# EAGLE design BIRDS-5_FM_-X Panel_Ver2 (EAGLE 9.6.2)
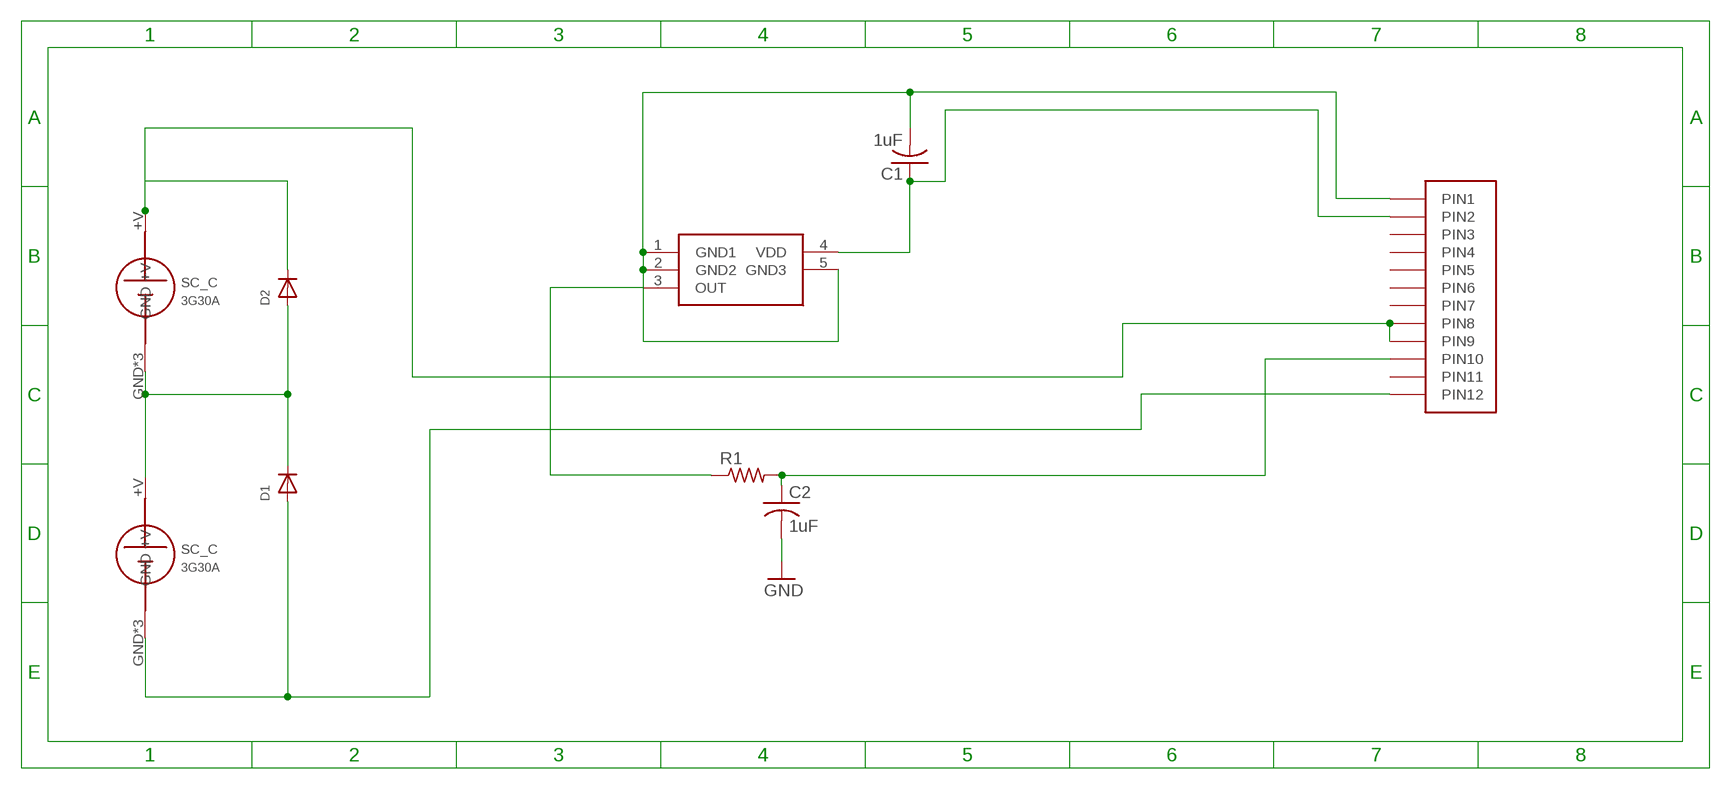
[diagram p0: schematic, sheet 1]

## Parts
C1  1uF  C-USC0805  [C0805]
C2  1uF  C-USC0805  [C0805]
D1  DIODE_SOD-123FL  [SOD-123FL]
D2  DIODE_SOD-123FL  [SOD-123FL]
R1  R-US_R0402  [R0402]
U$1  HEADER12PIN  [HEADER12PIN]
U$3  LMT84DCKT  [SOT65P210X110-5N]
U$4  SC_C  [SC_C]
U$5  SC_C  [SC_C]

## Nets
+V: D2.C U$1.P8(PIN8) U$1.P9(PIN9) U$4.+V
GND: C1.2 C2.2 D1.A U$1.P1(PIN1) U$1.P12(PIN12) U$3.1(GND1) U$3.2(GND2) U$3.5(GND3) U$5.GND U$5.GND1(GND) U$5.GND2(GND)
N$1: D1.C D2.A U$4.GND U$4.GND1(GND) U$4.GND2(GND) U$5.+V
N$2: R1.1 U$3.3(OUT)
N$3: C2.1 R1.2 U$1.P10(PIN10)
N$10: C1.1 U$1.P2(PIN2) U$3.4(VDD)
Unconnected: U$1.P3(PIN3) U$1.P4(PIN4) U$1.P5(PIN5) U$1.P6(PIN6) U$1.P7(PIN7) U$1.P11(PIN11)

## Library data of the parts
C1 C2 = adafruit:C-US: CAPACITOR, American symbol
D1 D2 = adafruit:DIODE: Diode SMADIODE - SMA Surface Mount Package 20V 1A Schottky Diode Digikey: 641-1014-6-ND DO-1N4148 - Through Hole Small Current Diode SOD-123 20V 1 A (.5mV Vf) Schottky Diode - Digikey: MBRX120TPMSCT-ND SOD-323 10V 570mA (.38mV Vf, 3ns) Schottky Diode - Digikey: ZLLS410CT-ND SOD-523 30V 30mA Schottky Diode (RB751S-40TE61) - Digikey: RB751S-40TE61CT-ND SOT23-R/W - SOT23 Package (R = Solder Paste/Reflow Ovens, W = Hand-Soldering) BAT54Film 40V 300mA - Digikey: 497-7162-1-ND
R1 = adafruit:R-US_: RESISTOR, American symbol
U$1 = BIRDS:HEADER12PIN
U$3 = LMT84DCKT:LMT84DCKT: 1.5V-Capable, 10 uA Analog Output Temperature Sensor in SC70 and TO-92 Source: Datasheet <http://uk.rs-online.com/web/p/products/8115860>; DESCRIPTION: 1.5V-Capable, 10 uA Analog Output Temperature Sensor in SC70 and TO-92; HEIGHT: 1.1mm; MANUFACTURER_NAME: Texas Instruments; MANUFACTURER_PART_NUMBER: LMT84DCKT; RS_PART_NUMBER: 8115860
U$4 U$5 = SC_C:SC_C

## Board
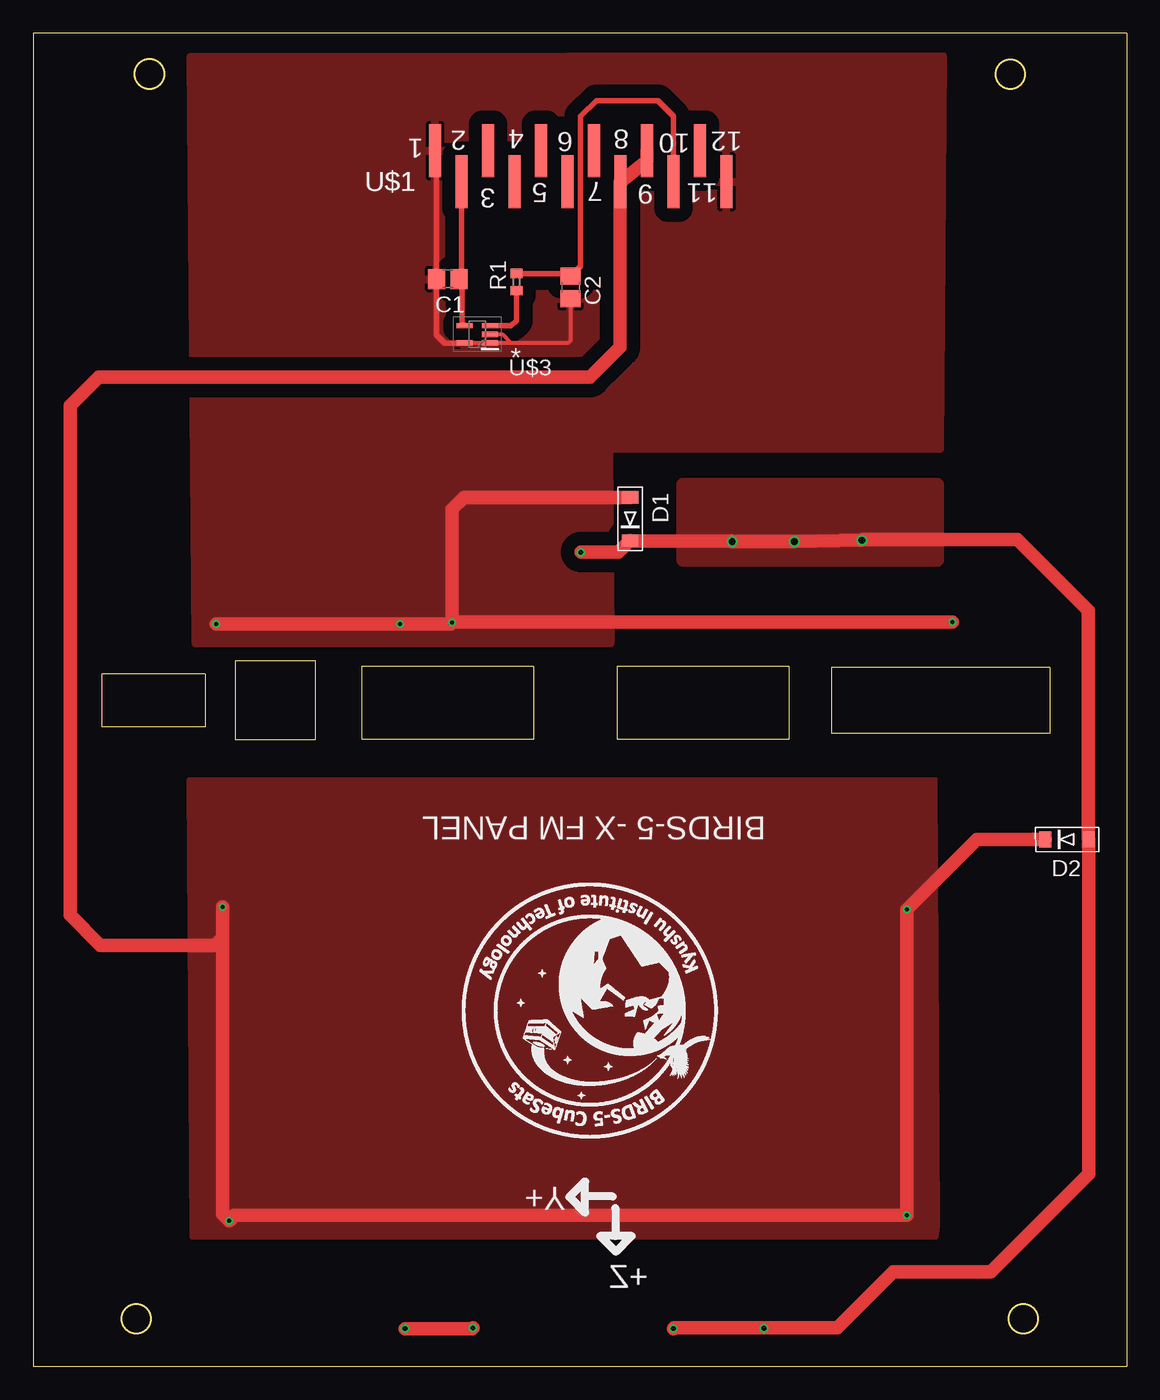
[diagram p1: board, top side]
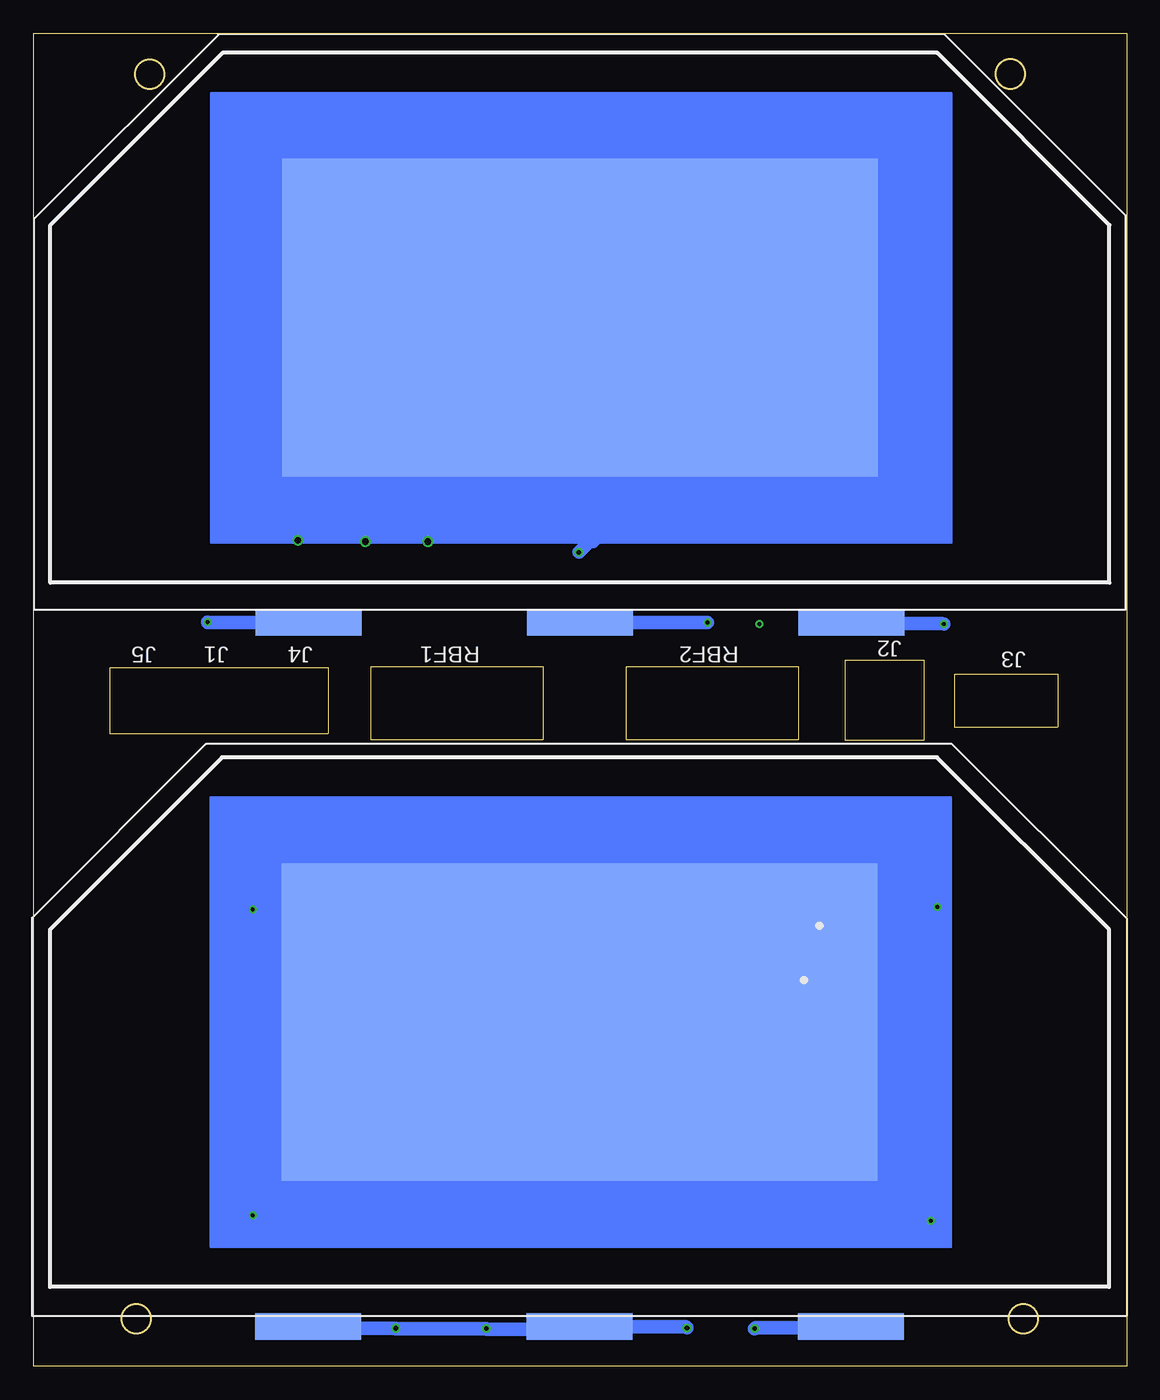
[diagram p2: board, bottom side, seen from below]

Size 82.6 x 100.7 mm. Coordinates in mm from the lower left corner, seen from the top.
Outline: 0,0 82.6,0 82.6,100.7 0,100.7 0,0
Outline: 13,52.3 5.2,52.3 5.2,48.3 13,48.3 13,52.3
Outline: 15.3,53.3 21.3,53.3 21.3,47.3 15.3,47.3 15.3,53.3
Outline: 37.8,52.85 24.8,52.85 24.8,47.35 37.8,47.35 37.8,52.85
Outline: 57.1,52.85 44.1,52.85 44.1,47.35 57.1,47.35 57.1,52.85
Outline: 76.8,52.8 60.3,52.8 60.3,47.8 76.8,47.8 76.8,52.8
Outline: circle at 8.78,97.62 radius 1.1
Outline: circle at 73.8,97.6 radius 1.1
Outline: circle at 7.79,3.6 radius 1.1
Outline: circle at 74.8,3.61 radius 1.1
Copper layers (1*16): Top 0.035mm / dielectric 1.53mm / Bottom 0.035mm
Design rules "pban_5mil-l2": minimum track width 5mil, minimum drill 0.3mm, track to track 5mil, track to pad 0.229mm, pad to pad 5mil, via to via 5mil, smd to smd 5mil, copper to edge 0.5mm, drill to drill 0.5mm, minimum pad ring 0.15mm, minimum via ring 0.15mm, stop-mask expansion 4mil, vias tented up to drill 0.35mm, thermal gap 10mil

### Footprints (pad centres in the part's own frame; a part is rotated, then mirrored left to right if it is on the bottom)
C0805 = smd 1.3 x 1.5: 1 -0.85,0; 2 0.85,0
SOD-123FL = smd 0.91 x 1.22 bottom: A 1.637,0; C -1.637,0
R0402 = smd 0.7 x 0.9: 1 -0.65,0; 2 0.65,0
HEADER12PIN = smd 4 x 0.89: P1 0,0; P2 2.35,2; P3 0,4; P4 2.35,6; P5 0,8; P6 2.35,10; P7 0,12; P8 2.35,14; P9 0,16; P10 2.35,18; P11 0,20; P12 2.35,22
SOT65P210X110-5N = smd 1.2 x 0.4: 1 -0.95,0.65; 2 -0.95,0; 3 -0.95,-0.65; 4 0.95,-0.65; 5 0.95,0.65
SC_C = smd 45 x 24 bottom: +V 40.1,20 | smd 8 x 2 bottom: GND 40.1,-3; GND1 19.6,-3; GND2 60.6,-3

### Placement (x,y rotation side)
C1  31.33,82.12 180 top
C2  40.6,81.5 270 top
D1  45.1,64 90 bottom
D2  78.1,39.8 180 bottom
R1  36.5,81.9 90 top
U$1  30.37,91.82 270 top
U$3  33.55,77.95 180 top
U$4  1.23,6 0 top
U$5  1.2,59.2 0 top

### Tracks (layer width: path | path; a pad name or v marks a point on that pad's centre or on a via)
+V  (via drill 0.3)
  Top 1.016: v14.3,34.7 14.3,32.4 | 14.3,32.4 13.7,31.8 5.09,31.8 2.79,34.1 2.79,72.55 4.94,74.7 42.05,74.7 44.31,76.97 44.31,89.42 U$1.P8 44.39,89.49 46.37,91.07 U$1.P9 | 14.3,32.4 14.3,11.5 v14.8,11 15.2,11.4 v66,11.4 v66,34.5 71.3,39.8 D2.C
  Bottom 1.016: U$4.+V 58.5,27 v66,34.5
  pour Top: 68.2,9.8 12,9.8 11.8,44.3 68.1,44.3 68.3,10.6
GND  (via drill 0.3)
  Top 0.305: C2.2 40.6,77.5 40.4,77.3 36.1,77.3 | 36.1,77.3 U$3.1 U$3.5 | U$3.2 35.45,77.95 36.1,77.3
  Top 0.406: U$1.P1 30.41,91.82 30.46,91.77 30.46,82.28 30.48,82.25 C1.2 30.48,77.9 31.08,77.3 U$3.5
  Top 1.016: v31.65,56.19 31.52,56.06 v27.73,56.06 v13.82,56.06 | v69.43,56.22 31.68,56.22 v31.65,56.19 | D1.A 32.54,65.64 31.65,64.75 v31.65,56.19
  Bottom 1.016: U$5.GND1 20.8,56.09 13.96,56.09 v13.82,56.06 | v69.43,56.22 69.4,56.19 U$5.GND2 | v31.65,56.19 v31.66,56.2 U$5.GND
  pour Top (isolate 1.016): 43.6,54.59 12.3,54.59 11.9,98.9 68.7,99 68.5,69.3 43.5,69.3
N$1  (via drill 0.35, 0.5)
  Top 1.016: v48.36,2.86 48.41,2.91 60.73,2.91 64.97,7.14 72.34,7.14 79.74,14.54 D2.A 79.7,39.84 79.7,57.1 74.35,62.45 62.65,62.45 v62.6,62.4 v57.5,62.3 v52.8,62.3 52.75,62.35 45.11,62.35 D1.C 44.23,61.49 v41.38,61.49 | v33.21,2.91 33.16,2.86 v28.1,2.86
  Bottom 0.152: 55.21,2.86 55.22,2.87 | 40.57,62.3 40.3,62.3 | 41.53,2.79 U$4.GND
  Bottom 1.016: 40.3,62.3 U$5.+V | U$4.GND1 20.91,3 20.88,2.91 28.05,2.91 v28.1,2.86 | U$4.GND 33.31,3 v33.21,2.91 | v55.2,2.88 55.22,2.87 61.69,2.87 U$4.GND2 | 41.53,2.79 48.3,2.79 v48.36,2.86 55.21,2.86 | v41.38,61.49 40.57,62.3
  pour Top (isolate 1.016): 68.3,60.9 49.1,60.9 49.1,66.6 68.3,66.6
N$2
  Top 0.406: R1.1 36.5,79 36.1,78.6 U$3.3
N$3
  Top 0.406: R1.2 40.4,82.55 C2.1 | 48.37,93.92 | 48.37,93.92 48.37,94.43 47.2,95.6 42.55,95.6 41.36,94.41 41.36,83.11 C2.1 | 48.37,93.92 U$1.P10 | C2.1
N$10
  Top 0.406: U$1.P2 32.35,89.45 32.35,82.29 C1.1 | U$3.4 32.4,78.8 32.4,81.7 32.4,82.13 | 32,81.7 32,81.68
  Top 0.61: 32.4,82.13 C1.1 32.26,81.96 32,81.7 | 32.4,81.7 32,81.68

### Text on the board
tPlace: BIRDS-5 -X FM PANEL | +Y | +Z
tNames: 1 | 2 | 4 | 6 | 8 | 10 | 12 | U$1 | U$1 | 3 | 5 | 7 | 9 | 11 | *
bNames: J2 | J3 | RBF2 | RBF1 | J4 | J1 | J5